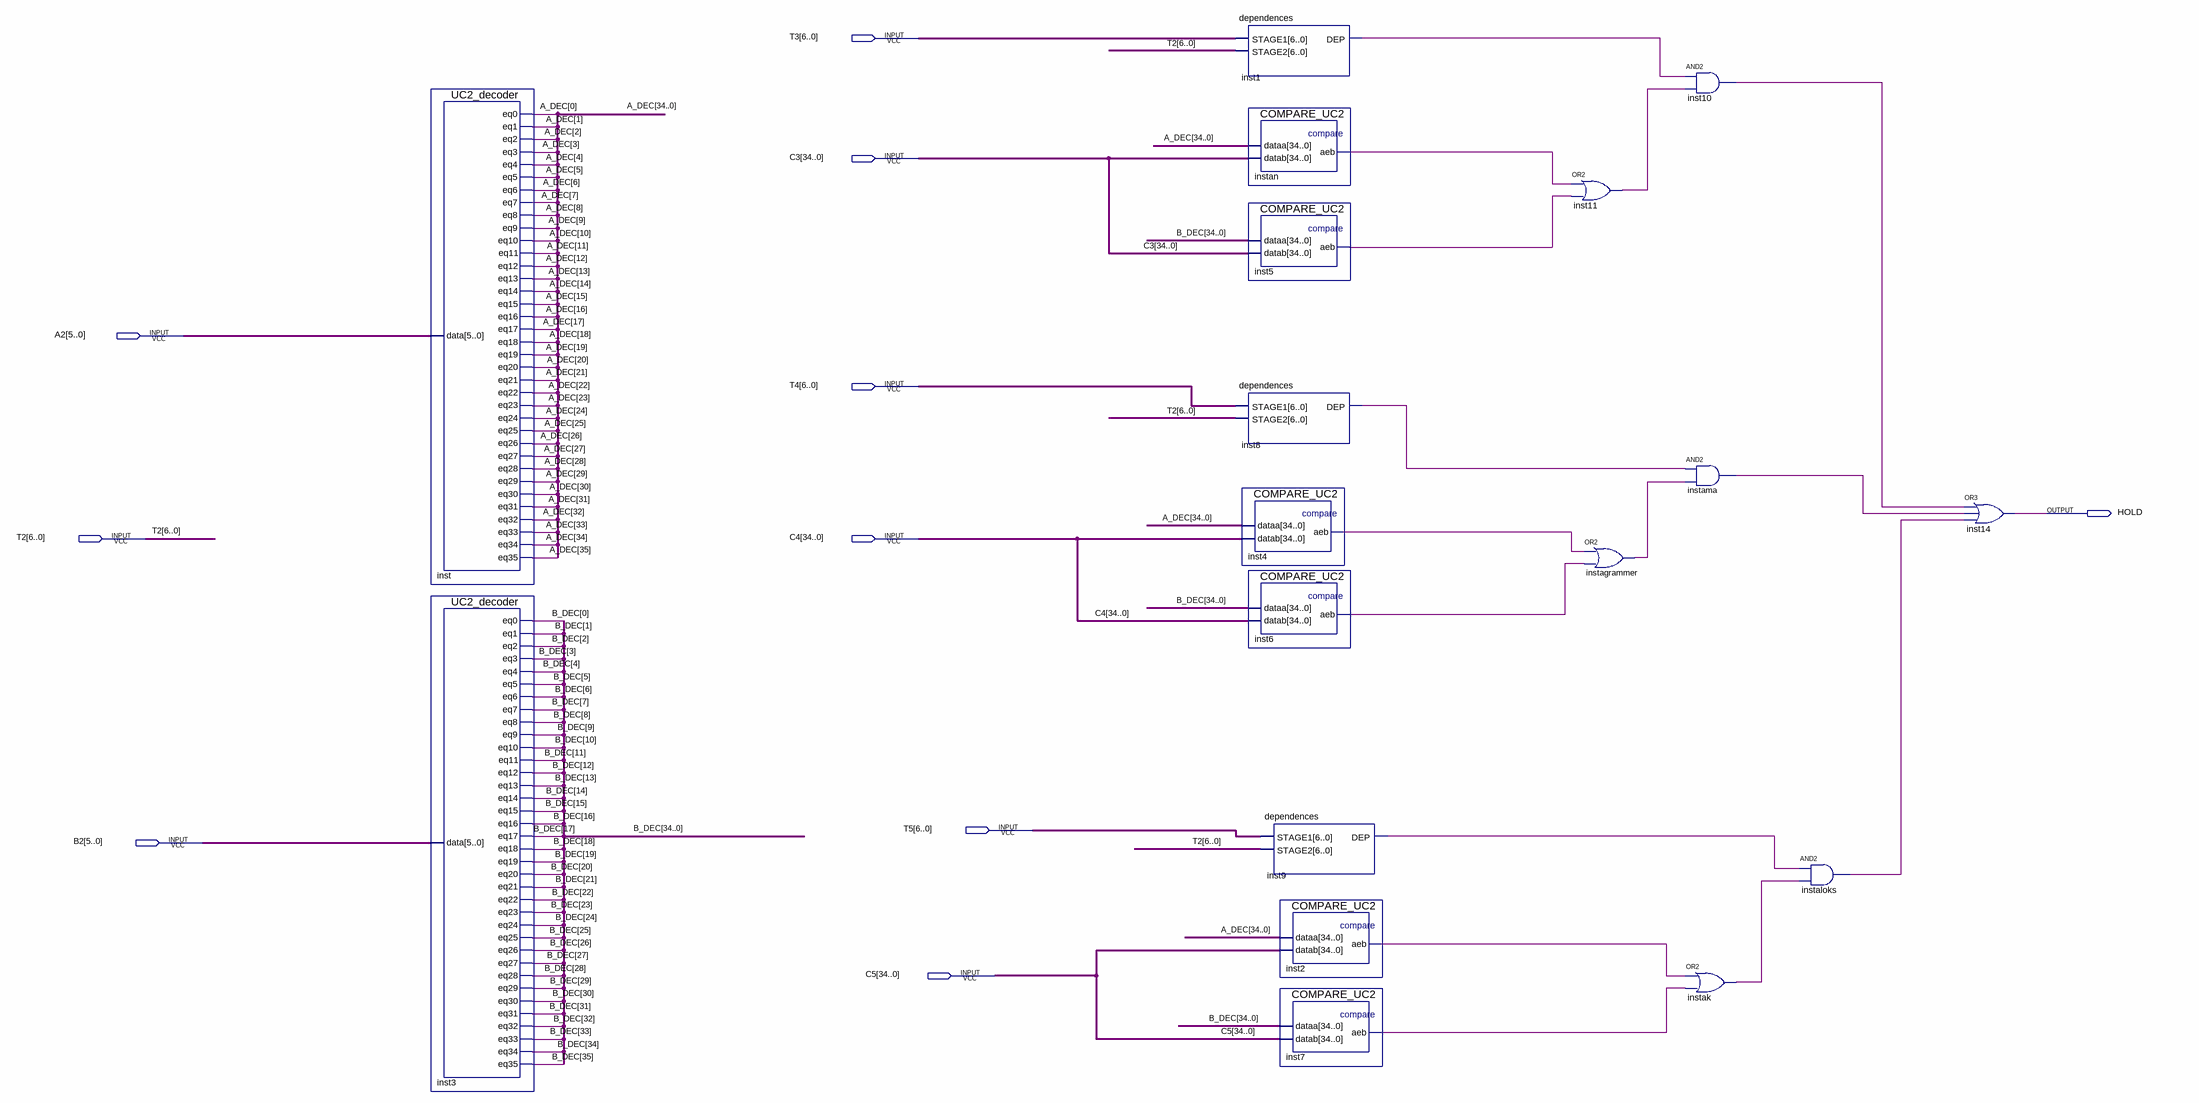
[diagram p0: schematic sheet]
// Quartus schematic UC2.bdf as structural Verilog: 18 symbols, 10 pins
module UC2 (
  input  [6:0] T3,
  input  [34:0] C3,
  input  [5:0] A2,
  input  [6:0] T4,
  input  [6:0] T2,
  input  [34:0] C4,
  input  [6:0] T5,
  input  [5:0] B2,
  input  [34:0] C5,
  output HOLD
);

  wire inst1_dep, inst2_aeb, inst4_aeb, inst5_aeb, inst6_aeb, inst7_aeb, inst8_dep, inst9_dep, inst10_out,
       inst11_out, instagrammer_out, instak_out, instaloks_out, instama_out, instan_aeb;
  wire [35:0] A_DEC, B_DEC;

  UC2_decoder inst (
    .data(A2), .eq0(A_DEC[0]), .eq1(A_DEC[1]), .eq2(A_DEC[2]), .eq3(A_DEC[3]), .eq4(A_DEC[4]),
    .eq5(A_DEC[5]), .eq6(A_DEC[6]), .eq7(A_DEC[7]), .eq8(A_DEC[8]), .eq9(A_DEC[9]), .eq10(A_DEC[10]),
    .eq11(A_DEC[11]), .eq12(A_DEC[12]), .eq13(A_DEC[13]), .eq14(A_DEC[14]), .eq15(A_DEC[15]),
    .eq16(A_DEC[16]), .eq17(A_DEC[17]), .eq18(A_DEC[18]), .eq19(A_DEC[19]), .eq20(A_DEC[20]),
    .eq21(A_DEC[21]), .eq22(A_DEC[22]), .eq23(A_DEC[23]), .eq24(A_DEC[24]), .eq25(A_DEC[25]),
    .eq26(A_DEC[26]), .eq27(A_DEC[27]), .eq28(A_DEC[28]), .eq29(A_DEC[29]), .eq30(A_DEC[30]),
    .eq31(A_DEC[31]), .eq32(A_DEC[32]), .eq33(A_DEC[33]), .eq34(A_DEC[34]), .eq35(A_DEC[35]));
  UC2_decoder inst3 (
    .data(B2), .eq0(B_DEC[0]), .eq1(B_DEC[1]), .eq2(B_DEC[2]), .eq3(B_DEC[3]), .eq4(B_DEC[4]),
    .eq5(B_DEC[5]), .eq6(B_DEC[6]), .eq7(B_DEC[7]), .eq8(B_DEC[8]), .eq9(B_DEC[9]), .eq10(B_DEC[10]),
    .eq11(B_DEC[11]), .eq12(B_DEC[12]), .eq13(B_DEC[13]), .eq14(B_DEC[14]), .eq15(B_DEC[15]),
    .eq16(B_DEC[16]), .eq17(B_DEC[17]), .eq18(B_DEC[18]), .eq19(B_DEC[19]), .eq20(B_DEC[20]),
    .eq21(B_DEC[21]), .eq22(B_DEC[22]), .eq23(B_DEC[23]), .eq24(B_DEC[24]), .eq25(B_DEC[25]),
    .eq26(B_DEC[26]), .eq27(B_DEC[27]), .eq28(B_DEC[28]), .eq29(B_DEC[29]), .eq30(B_DEC[30]),
    .eq31(B_DEC[31]), .eq32(B_DEC[32]), .eq33(B_DEC[33]), .eq34(B_DEC[34]), .eq35(B_DEC[35]));
  dependences inst1 (.STAGE1(T3), .STAGE2(T2), .DEP(inst1_dep));
  COMPARE_UC2 instan (.dataa(A_DEC[34:0]), .datab(C3), .aeb(instan_aeb));
  COMPARE_UC2 inst5 (.dataa(B_DEC[34:0]), .datab(C3), .aeb(inst5_aeb));
  dependences inst8 (.STAGE1(T4), .STAGE2(T2), .DEP(inst8_dep));
  COMPARE_UC2 inst4 (.dataa(A_DEC[34:0]), .datab(C4), .aeb(inst4_aeb));
  COMPARE_UC2 inst6 (.dataa(B_DEC[34:0]), .datab(C4), .aeb(inst6_aeb));
  dependences inst9 (.STAGE1(T5), .STAGE2(T2), .DEP(inst9_dep));
  COMPARE_UC2 inst2 (.dataa(A_DEC[34:0]), .datab(C5), .aeb(inst2_aeb));
  COMPARE_UC2 inst7 (.dataa(B_DEC[34:0]), .datab(C5), .aeb(inst7_aeb));
  or inst11 (inst11_out, instan_aeb, inst5_aeb);
  or instagrammer (instagrammer_out, inst4_aeb, inst6_aeb);
  and inst10 (inst10_out, inst1_dep, inst11_out);
  and instama (instama_out, inst8_dep, instagrammer_out);
  or instak (instak_out, inst2_aeb, inst7_aeb);
  and instaloks (instaloks_out, inst9_dep, instak_out);
  or inst14 (HOLD, inst10_out, instama_out, instaloks_out);
endmodule
